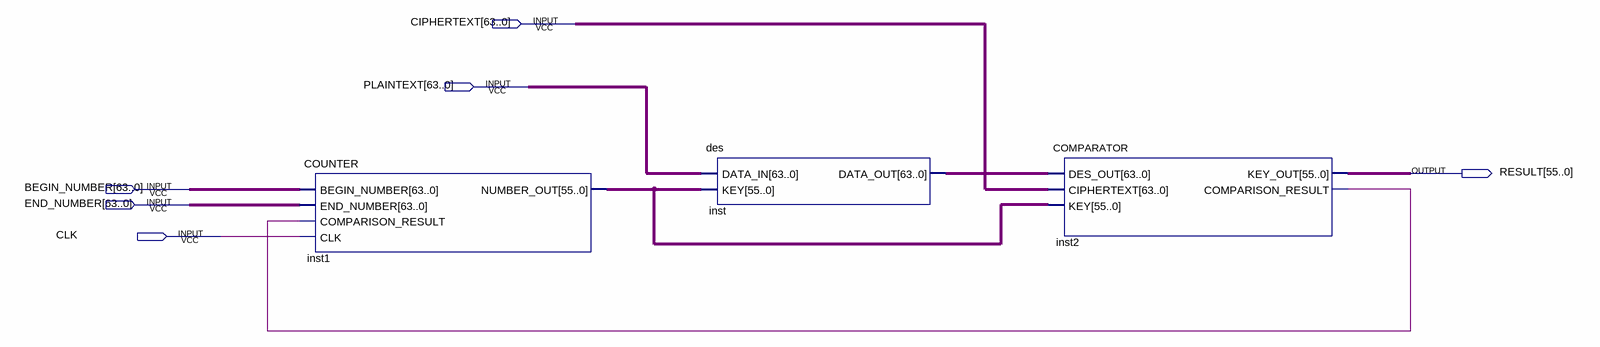
[diagram p0: schematic sheet]
// Quartus schematic DONE.bdf as structural Verilog: 3 symbols, 6 pins
module DONE (
  input  [63:0] CIPHERTEXT,
  input  [63:0] PLAINTEXT,
  input  [63:0] BEGIN_NUMBER,
  input  [63:0] END_NUMBER,
  input  CLK,
  output [55:0] RESULT
);

  wire inst2_comparison_result;
  wire [55:0] inst1_number_out;
  wire [63:0] inst_data_out;

  COUNTER inst1 (
    .BEGIN_NUMBER(BEGIN_NUMBER), .END_NUMBER(END_NUMBER), .COMPARISON_RESULT(inst2_comparison_result),
    .CLK(CLK), .NUMBER_OUT(inst1_number_out));
  des inst (.DATA_IN(PLAINTEXT), .KEY(inst1_number_out), .DATA_OUT(inst_data_out));
  COMPARATOR inst2 (
    .DES_OUT(inst_data_out), .CIPHERTEXT(CIPHERTEXT), .KEY(inst1_number_out), .KEY_OUT(RESULT),
    .COMPARISON_RESULT(inst2_comparison_result));
endmodule
